# Altium schematic sheet Bank33.SchDoc
size A3; SheetNumber: 6; SheetTotal: 9
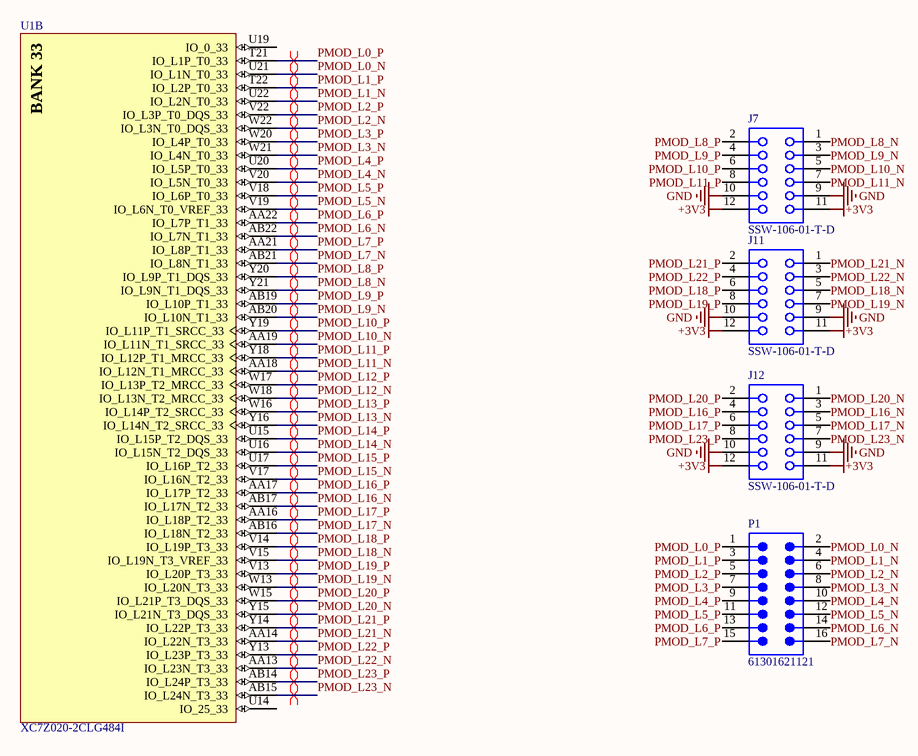
[diagram p0: Bank33.SchDoc]

## Parts
J7  SSW-106-01-T-D  [SMTC-SSW-106-01-X-D]
J11  SSW-106-01-T-D  [SMTC-SSW-106-01-X-D]
J12  SSW-106-01-T-D  [SMTC-SSW-106-01-X-D]
P1  61301621121  [61301621121]
U1  XC7Z020-2CLG484I  [CLG484]  (part B of 10)

## Nets
+3V3: J7.11 J7.12 J11.11 J11.12 J12.11 J12.12
GND: J7.9 J7.10 J11.9 J11.10 J12.9 J12.10
PMOD_L0_N: P1.2 U1.U21(IO_L1N_T0_33)
PMOD_L0_P: P1.1 U1.T21(IO_L1P_T0_33)
PMOD_L1_N: P1.4 U1.U22(IO_L2N_T0_33)
PMOD_L1_P: P1.3 U1.T22(IO_L2P_T0_33)
PMOD_L2_N: P1.6 U1.W22(IO_L3N_T0_DQS_33)
PMOD_L2_P: P1.5 U1.V22(IO_L3P_T0_DQS_33)
PMOD_L3_N: P1.8 U1.W21(IO_L4N_T0_33)
PMOD_L3_P: P1.7 U1.W20(IO_L4P_T0_33)
PMOD_L4_N: P1.10 U1.V20(IO_L5N_T0_33)
PMOD_L4_P: P1.9 U1.U20(IO_L5P_T0_33)
PMOD_L5_N: P1.12 U1.V19(IO_L6N_T0_VREF_33)
PMOD_L5_P: P1.11 U1.V18(IO_L6P_T0_33)
PMOD_L6_N: P1.14 U1.AB22(IO_L7N_T1_33)
PMOD_L6_P: P1.13 U1.AA22(IO_L7P_T1_33)
PMOD_L7_N: P1.16 U1.AB21(IO_L8N_T1_33)
PMOD_L7_P: P1.15 U1.AA21(IO_L8P_T1_33)
PMOD_L8_N: J7.1 U1.Y21(IO_L9N_T1_DQS_33)
PMOD_L8_P: J7.2 U1.Y20(IO_L9P_T1_DQS_33)
PMOD_L9_N: J7.3 U1.AB20(IO_L10N_T1_33)
PMOD_L9_P: J7.4 U1.AB19(IO_L10P_T1_33)
PMOD_L10_N: J7.5 U1.AA19(IO_L11N_T1_SRCC_33)
PMOD_L10_P: J7.6 U1.Y19(IO_L11P_T1_SRCC_33)
PMOD_L11_N: J7.7 U1.AA18(IO_L12N_T1_MRCC_33)
PMOD_L11_P: J7.8 U1.Y18(IO_L12P_T1_MRCC_33)
PMOD_L12_N: U1.W18(IO_L13N_T2_MRCC_33)
PMOD_L12_P: U1.W17(IO_L13P_T2_MRCC_33)
PMOD_L13_N: U1.Y16(IO_L14N_T2_SRCC_33)
PMOD_L13_P: U1.W16(IO_L14P_T2_SRCC_33)
PMOD_L14_N: U1.U16(IO_L15N_T2_DQS_33)
PMOD_L14_P: U1.U15(IO_L15P_T2_DQS_33)
PMOD_L15_N: U1.V17(IO_L16N_T2_33)
PMOD_L15_P: U1.U17(IO_L16P_T2_33)
PMOD_L16_N: J12.3 U1.AB17(IO_L17N_T2_33)
PMOD_L16_P: J12.4 U1.AA17(IO_L17P_T2_33)
PMOD_L17_N: J12.5 U1.AB16(IO_L18N_T2_33)
PMOD_L17_P: J12.6 U1.AA16(IO_L18P_T2_33)
PMOD_L18_N: J11.5 U1.V15(IO_L19N_T3_VREF_33)
PMOD_L18_P: J11.6 U1.V14(IO_L19P_T3_33)
PMOD_L19_N: J11.7 U1.W13(IO_L20N_T3_33)
PMOD_L19_P: J11.8 U1.V13(IO_L20P_T3_33)
PMOD_L20_N: J12.1 U1.Y15(IO_L21N_T3_DQS_33)
PMOD_L20_P: J12.2 U1.W15(IO_L21P_T3_DQS_33)
PMOD_L21_N: J11.1 U1.AA14(IO_L22N_T3_33)
PMOD_L21_P: J11.2 U1.Y14(IO_L22P_T3_33)
PMOD_L22_N: J11.3 U1.AA13(IO_L23N_T3_33)
PMOD_L22_P: J11.4 U1.Y13(IO_L23P_T3_33)
PMOD_L23_N: J12.7 U1.AB15(IO_L24N_T3_33)
PMOD_L23_P: J12.8 U1.AB14(IO_L24P_T3_33)

Not connected (* = marked no-connect by the designer): U1 U14(IO_25_33) U19(IO_0_33)

## Layout directives
differential pair: PMOD_L0_N, PMOD_L0_P, PMOD_L1_N, PMOD_L1_P, PMOD_L2_N, PMOD_L2_P, PMOD_L3_N, PMOD_L3_P, PMOD_L4_N, PMOD_L4_P, PMOD_L5_N, PMOD_L5_P, PMOD_L6_N, PMOD_L6_P, PMOD_L7_N, PMOD_L7_P, PMOD_L8_N, PMOD_L8_P, PMOD_L9_N, PMOD_L9_P, PMOD_L10_N, PMOD_L10_P, PMOD_L11_N, PMOD_L11_P, PMOD_L12_N, PMOD_L12_P, PMOD_L13_N, PMOD_L13_P, PMOD_L14_N, PMOD_L14_P, PMOD_L15_N, PMOD_L15_P, PMOD_L16_N, PMOD_L16_P, PMOD_L17_N, PMOD_L17_P, PMOD_L18_N, PMOD_L18_P, PMOD_L19_N, PMOD_L19_P, PMOD_L20_N, PMOD_L20_P, PMOD_L21_N, PMOD_L21_P, PMOD_L22_N, PMOD_L22_P, PMOD_L23_N, PMOD_L23_P

## Notes on the sheet
- (in symbol CMP-0363-00013-3, part B) BANK 33

## Library data of the parts
J7 J11 J12 = CMP-1023-00356-1: SQ Post Socket, Through-hole, Vertical, -55 to 105 degC, 2.54mm Pitch, 12-Pin, Female, RoHS; Manufacturer: Samtec; ComponentLink1Description: Manufacturer URL; RoHS: True; Mounting Technology: Through-hole; ComponentLink1URL: http://www.samtec.com; PackageVersion: CA, 6/1987; DatasheetVersion: F-214; PackageReference: SSW-106-01-X-D; Temperature Range: -55 to 105 degC; PartNumber: SSW-106-01-T-D; ComponentLink3URL: http://www.samtec.com/documents/webfiles/cpdf/SSW-1XX-XX-XXX-X-XX-XXX-XX-MKT.pdf; ComponentLink2URL: http://www.samtec.com/documents/webfiles/pdf/SSW_TH.PDF; Pitch: 2.54 mm; Orientation: Vertical; ComponentLink3Description: Package Specification; ComponentLink2Description: Datasheet; PackageDescription: Assembly, Socket Strip .016 X .031 Tail
P1 = CMP-1502-01097-2
U1 = CMP-0363-00013-3: 733 MHz Zynq™-7000 AP SoC, 130 PS I/O, 200 FPGA I/O, 484-Ball BGA, Speed Grade 2, Industrial Grade, Pb-Free; Speed Grade: -2; Flip Flops: 106400; LUTs: 53200; Extensible Block RAM (# 36Kb Blocks): 560 KB (140); ComponentLink3URL: http://www.xilinx.com/support/documentation/data_sheets/ds187-XC7Z010-XC7Z020-Data-Sheet.pdf; PackageReference: CLG484; Code_JEDEC: MO-275-PPAA-2; ComponentLink2URL: http://www.xilinx.com/support/documentation/user_guides/ug865-Zynq-7000-Pkg-Pinout.pdf; ComponentLink2Description: Package Specification; ComponentLink6URL: http://www.xilinx.com/support/documentation/user_guides/ug483_7Series_PCB.pdf; PackageVersion: Rev 1.1, 09/2012; DatasheetVersion: v1.2; PartNumber: XC7Z020-2CLG484I; ComponentLink3Description: DC and AC Switching Characteristics; PackageDescription: Wire-Bond Chip-Scale BGA, Body 19 x 19 mm, 0.8 mm Pitch; RoHS: Pb-Free; ComponentLink5URL: http://www.xilinx.com/support/documentation/user_guides/ug865-Zynq-7000-Pkg-Pinout.pdf; ComponentLink1URL: http://www.xilinx.com/support/documentation/data_sheets/ds190-Zynq-7000-Overview.pdf; ComponentLink4Description: Package File; Generic Part Number: XC7Z020; Mounting Technology: Surface Mount; ComponentLink1Description: Datasheet; ComponentLink4URL: http://www.xilinx.com/support/packagefiles/z7packages/xc7z020clg484pkg.txt; ComponentLink6Description: PCB and Layout Guide; ComponentLink5Description: Packaging and Pinout